# Altium project 3562.PrjPcb (part 2 of 5)

## Sheet P04_POWER.SchDoc
size 420 x 297 mm
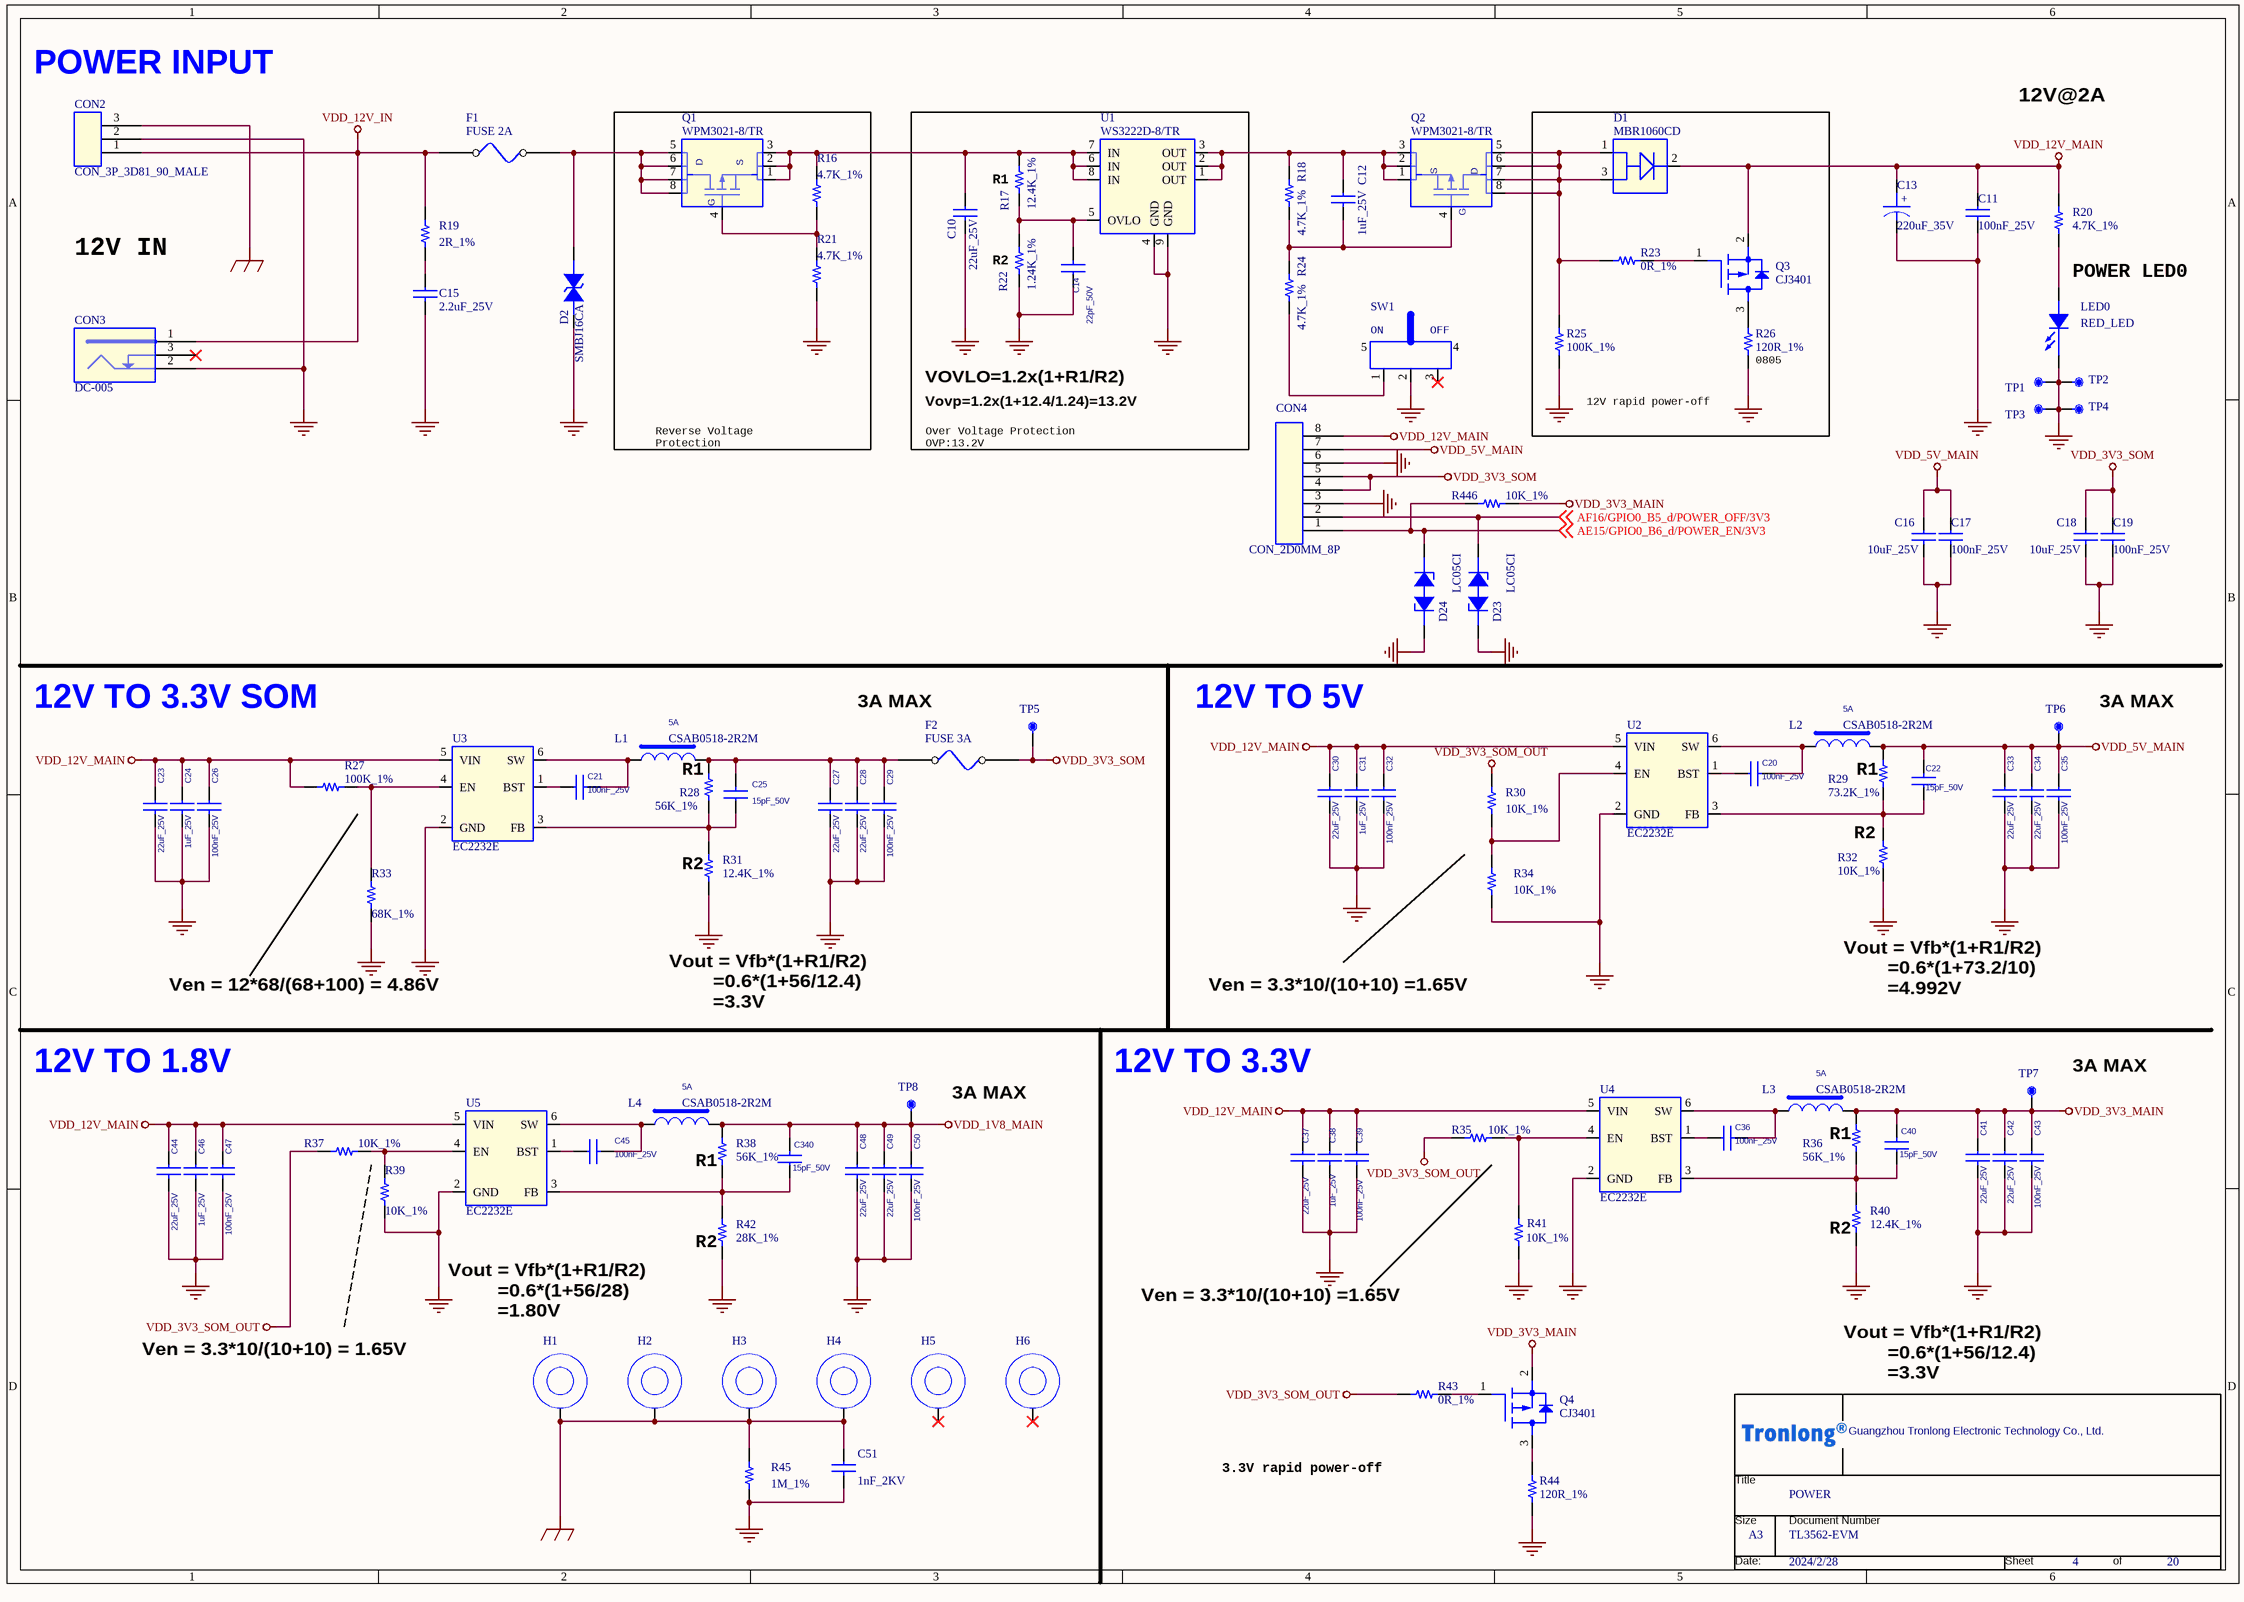
[diagram p11: P04_POWER.SchDoc]

### Parts
(Parts that share a designator on the sheet are numbered #1, #2 ... from top to bottom, then left to right.)
*#4  Page Count: 20  Page Number: 4  Page Size: A3  OrgName: Guangzhou Tronlong Electronic Technology Co., Ltd.  Title: POWER  Doc: TL3562-EVM  Page Modify Date: 2024/2/28  (hidden comment: Tronlong_TITTLE_20211115)  (graphical)
C10  22uF_25V  [C0805]
C11  100nF_25V  [C0402]
C12  1uF_25V  [C0603]
C13  220uF_35V  [cap_alu_smd_8x10d5]
C14  22pF_50V  [C0603]
C15  2.2uF_25V  [C1206]
C16  10uF_25V  [C0603]
C17  100nF_25V  [C0402]
C18  10uF_25V  [C0603]
C19  100nF_25V  [C0402]
C20  100nF_25V  [C0402]
C21  100nF_25V  [C0402]
C22  15pF_50V  [C0402]
C23  22uF_25V  [C0805]
C24  1uF_25V  [C0603]
C25  15pF_50V  [C0402]
C26  100nF_25V  [C0402]
C27  22uF_25V  [C0805]
C28  22uF_25V  [C0805]
C29  100nF_25V  [C0402]
C30  22uF_25V  [C0805]
C31  1uF_25V  [C0603]
C32  100nF_25V  [C0402]
C33  22uF_25V  [C0805]
C34  22uF_25V  [C0805]
C35  100nF_25V  [C0402]
C36  100nF_25V  [C0402]
C37  22uF_25V  [C0805]
C38  1uF_25V  [C0603]
C39  100nF_25V  [C0402]
C40  15pF_50V  [C0402]
C41  22uF_25V  [C0805]
C42  22uF_25V  [C0805]
C43  100nF_25V  [C0402]
C44  22uF_25V  [C0805]
C45  100nF_25V  [C0402]
C46  1uF_25V  [C0603]
C47  100nF_25V  [C0402]
C48  22uF_25V  [C0805]
C49  22uF_25V  [C0805]
C50  100nF_25V  [C0402]
C51  1nF_2KV  [C1210]
C340  15pF_50V  [C0402]
CON2  CON_3P_3D81_90_MALE  [CON_3P_3D81_90_MALE_NEW]
CON3  DC-005  [con_dc005_new]
CON4  CON_2D0MM_8P  [DIP_CON_2D0MM_8P]
D1  MBR1060CD  [TO-252]
D2  SMBJ16CA  [SMB]
D23  LC05CI  [SOD323_BI]
D24  LC05CI  [SOD323_BI]
F1  FUSE 2A  [F1206]
F2  FUSE 3A  [F1206]
H1  HOLE  [MHOLE_C200D125]  (value not drawn)
H2  HOLE  [MHOLE_C200D125]  (value not drawn)
H3  HOLE  [MHOLE_C200D125]  (value not drawn)
H4  HOLE  [MHOLE_C200D125]  (value not drawn)
H5  HOLE  [MHOLE_C200D125]  (value not drawn)
H6  HOLE  [MHOLE_C200D125]  (value not drawn)
L1  CSAB0518-2R2M  Current: 5A  [SMD_CSAB0518]
L2  CSAB0518-2R2M  Current: 5A  [SMD_CSAB0518]
L3  CSAB0518-2R2M  Current: 5A  [SMD_CSAB0518]
L4  CSAB0518-2R2M  Current: 5A  [SMD_CSAB0518]
LED0  RED_LED  [CON_2P_3MM]
Q1  WPM3021-8/TR  [PSOPSOP-8L]
Q2  WPM3021-8/TR  [PSOPSOP-8L]
Q3  CJ3401  [SOT23-3]
Q4  CJ3401  [SOT23-3]
R16  4.7K_1%  [R0402]
R17  12.4K_1%  [R0402]
R18  4.7K_1%  [R0402]
R19  2R_1%  [R1210]
R20  4.7K_1%  [R0402]
R21  4.7K_1%  [R0402]
R22  1.24K_1%  [R0603]
R23  0R_1%  [R0402]
R24  4.7K_1%  [R0402]
R25  100K_1%  [R0402]
R26  120R_1%  [R0805]
R27  100K_1%  [R0402]
R28  56K_1%  [R0402]
R29  73.2K_1%  [R0402]
R30  10K_1%  [R0402]
R31  12.4K_1%  [R0402]
R32  10K_1%  [R0402]
R33  68K_1%  [R0402]
R34  10K_1%  [R0402]
R35  10K_1%  [R0402]
R36  56K_1%  [R0402]
R37  10K_1%  [R0402]
R38  56K_1%  [R0402]
R39  10K_1%  [R0402]
R40  12.4K_1%  [R0402]
R41  10K_1%  [R0402]
R42  28K_1%  [R0402]
R43  0R_1%  [R0402]
R44  120R_1%  [R0805]
R45  1M_1%  [R0603]
R446  10K_1%  [R0402]
SW1  SS-12D11L5  [sw-126_76]  (value not drawn)
TP1  Black Test Point  [TP_DIP]  (value not drawn)
TP2  Black Test Point  [TP_DIP]  (value not drawn)
TP3  Black Test Point  [TP_DIP]  (value not drawn)
TP4  Black Test Point  [TP_DIP]  (value not drawn)
TP5  SMT TP  [TP30]  (value not drawn)
TP6  SMT TP  [TP30]  (value not drawn)
TP7  SMT TP  [TP30]  (value not drawn)
TP8  SMT TP  [TP30]  (value not drawn)
U1  WS3222D-8/TR  [DFN2X2-8L]
U2  EC2232E  [SOT-23-6L]
U3  EC2232E  [SOT-23-6L]
U4  EC2232E  [SOT-23-6L]
U5  EC2232E  [SOT-23-6L]

### Blocks framed on the sheet
VOVLO=1.2x(1+R1/R2): C10 C14 R17 R22 U1

### Nets
EGND: C51.1 CON2.3 H1.1 H2.1 H3.1 H4.1 R45.1
GND: C10.2 C11.2 C13.2 C14.1 C15.2 C16.2 C17.2 C18.2 C19.2 C23.2 C24.2 C26.2 C27.2 C28.2 C29.2 C30.2 C31.2 C32.2 C33.2 C34.2 C35.2 C37.2 C38.2 C39.2 C41.2 C42.2 C43.2 C44.2 C46.2 C47.2 C48.2 C49.2 C50.2 C51.2 CON2.2 CON3.2 CON4.3 CON4.6 D2.1 D23.2(CATHODE2) D24.2(CATHODE2) LED0.2(CATHODE) R21.1 R22.2 R25.1 R26.2 R31.1 R32.1 R33.1 R34.1 R39.1 R40.1 R41.1 R42.1 R44.2 R45.2 SW1.2 TP1.1 TP2.1 TP3.1 TP4.1 U1.4(GND) U1.9(GND) U2.2(GND) U3.2(GND) U4.2(GND) U5.2(GND)
VDD_1V8_MAIN: C48.1 C49.1 C50.1 C340.2 L4.2 R38.2 TP8.1
VDD_3V3_MAIN: C40.2 C41.1 C42.1 C43.1 L3.2 Q4.2(SOURCE) R36.2 R446.1 TP7.1
VDD_3V3_SOM: C18.1 C19.1 CON4.4 CON4.5 F2.2 TP5.1
VDD_3V3_SOM_OUT: R30.2 R35.2 R37.1 R43.2
VDD_5V_MAIN: C16.1 C17.1 C22.2 C33.1 C34.1 C35.1 CON4.7 L2.2 R29.2 TP6.1
VDD_12V_IN: CON2.1 CON3.1 F1.1 R19.2
VDD_12V_MAIN: C11.1 C13.1 C23.1 C24.1 C26.1 C30.1 C31.1 C32.1 C37.1 C38.1 C39.1 C44.1 C46.1 C47.1 CON4.8 D1.2 Q3.2(SOURCE) R20.1 R27.1 U2.5(VIN) U3.5(VIN) U4.5(VIN) U5.5(VIN)
AE15/GPIO0_B6_d/POWER_EN/3V3: CON4.1 D24.1(ANODE1) R446.2 ; off-sheet AE15/GPIO0_B6_d/POWER_EN/3V3
AF16/GPIO0_B5_d/POWER_OFF/3V3: CON4.2 D23.1(ANODE1) ; off-sheet AF16/GPIO0_B5_d/POWER_OFF/3V3
NetC10_1: C10.1 Q1.1(S1) Q1.2(S2) Q1.3(S3) R16.2 R17.1 U1.6(IN) U1.7(IN) U1.8(IN)
NetC12_1: C12.1 Q2.1(S1) Q2.2(S2) Q2.3(S3) R18.2 U1.1(OUT) U1.2(OUT) U1.3(OUT)
NetC12_2: C12.2 Q2.4(G) R18.1 R24.2
NetC14_2: C14.2 R17.2 R22.1 U1.5(OVLO)
NetC15_1: C15.1 R19.1
NetC20_1: C20.1 U2.1(BST)
NetC20_2: C20.2 L2.1 U2.6(SW)
NetC21_1: C21.1 U3.1(BST)
NetC21_2: C21.2 L1.1 U3.6(SW)
NetC22_1: C22.1 R29.1 R32.2 U2.3(FB)
NetC25_1: C25.1 R28.1 R31.2 U3.3(FB)
NetC25_2: C25.2 C27.1 C28.1 C29.1 F2.1 L1.2 R28.2
NetC36_1: C36.1 U4.1(BST)
NetC36_2: C36.2 L3.1 U4.6(SW)
NetC40_1: C40.1 R36.1 R40.2 U4.3(FB)
NetC45_1: C45.1 U5.1(BST)
NetC45_2: C45.2 L4.1 U5.6(SW)
NetC340_1: C340.1 R38.1 R42.2 U5.3(FB)
NetD1_1: D1.1 D1.3 Q2.5(D1) Q2.6(D2) Q2.7(D3) Q2.8(D4) R23.2 R25.2
NetD2_2: D2.2 F1.2 Q1.5(D1) Q1.6(D2) Q1.7(D3) Q1.8(D4)
NetLED0_1: LED0.1(ANODE) R20.2
NetQ1_4: Q1.4(G) R16.1 R21.2
NetQ3_1: Q3.1(GATE) R23.1
NetQ3_3: Q3.3(DRAIN) R26.1
NetQ4_1: Q4.1(GATE) R43.1
NetQ4_3: Q4.3(DRAIN) R44.1
NetR24_1: R24.1 SW1.1
NetR27_2: R27.2 R33.2 U3.4(EN)
NetR30_1: R30.1 R34.2 U2.4(EN)
NetR35_1: R35.1 R41.2 U4.4(EN)
NetR37_2: R37.2 R39.2 U5.4(EN)

Not connected (* = marked no-connect by the designer): CON3 3*; H5 1*; H6 1*; SW1 3* 4 5

### Notes on the sheet
- (near CON2) POWER INPUT
- 12V@2A
- (near R17) R1
- 12V IN
- (near R22) R2
- POWER LED0
- (near R26) 0805
- Reverse Voltage
  Protection
- Over Voltage Protection
  OVP:13.2V
- Vovp=1.2x(1+12.4/1.24)=13.2V
- 12V rapid power-off
- 12V TO 3.3V SOM
- 3A MAX
- 12V TO 5V
- (near TP6) 3A MAX
- (near L1) R1
- R1
- (near R32) R2
- (near R31) R2
- Ven = 12*68/(68+100) = 4.86V
- Ven = 3.3*10/(10+10) =1.65V
- Vout = Vfb*(1+R1/R2)
  =0.6*(1+73.2/10)
  =4.992V
- Vout = Vfb*(1+R1/R2)
  =0.6*(1+56/12.4)
  =3.3V
- (near TP7) 3A MAX
- 12V TO 1.8V
- (near TP8) 3A MAX
- 12V TO 3.3V
- (near R38) R1
- (near R42) R2
- (near R40) R2
- (near R42) Vout = Vfb*(1+R1/R2)
  =0.6*(1+56/28)
  =1.80V
- Ven = 3.3*10/(10+10) = 1.65V
- 3.3V rapid power-off
- (in symbol CAP POL_Dup1) +
- (in symbol switch_7) ON; OFF
- (in symbol Tronlong_TITTLE_20211115) Title; Size; Document Number; Date:; Sheet; of
- (in symbol WPM3021) S; D

### Library data of the parts
*#4 = Tronlong_TITTLE_20211115: RevCode: A?; Page Create Date: March  8, 1995
C10 C37 C41 C42 = CAP NP_Dup3: 贴片陶瓷电容,22uF,20%,25V,X5R; Manufacturer Character: 中国大陆; Operation Temperature（℃）: -55~85℃; As-Welded: /; Temperature: -55~125℃; PCB Footprint: C0805
C11 = CAP NP_Dup3: 贴片陶瓷电容,100nF,10%,25V,X5R; Manufacturer Character: 中国大陆; As-Welded: /; Operation Temperature（℃）: -55~85℃; room: DCIN; Temperature: -55~125℃; PCB Footprint: C0402
C12 C38 = CAP NP_Dup3: 贴片陶瓷电容,1uF,10%,25V,X5R; Manufacturer Character: 中国大陆; As-Welded: /; Operation Temperature（℃）: -55~85℃; PCB Footprint: C0603
C13 = CAP POL_Dup1: 贴片式铝电解电容,220uF,20%,35V; Manufacturer PartNumber: RVT1V221M0810VG; Manufacturer: 东莞市合粤电子有限公司（Heyue）; Manufacturer Character: 中国大陆; As-Welded: /; room: DCIN; Operation Temperature（℃）: -55~105℃; Temperature: -55~105℃; PCB Footprint: cap_alu_smd_8x10d5
C14 = CAP NP_Dup3: 贴片陶瓷电容,22pF,5%,50V,C0G; Manufacturer Character: 中国大陆; As-Welded: /; Operation Temperature（℃）: -55~125℃; Temperature: -55~125℃; PCB Footprint: C0603
C15 = CAP NP_Dup3: 贴片陶瓷电容,2.2uF,20%,25V,Y5V; Manufacturer Character: 中国大陆; As-Welded: /; Operation Temperature（℃）: -20~85℃; PCB Footprint: C1206
C16 C18 = CAP NP_Dup3: 贴片陶瓷电容,10uF,10%,10V,X5R; Manufacturer Character: 中国大陆; As-Welded: /; Operation Temperature（℃）: -55~85℃; PCB Footprint: C0603
C17 C19-C21 C26 C29 C32 C35 = CAP NP_Dup3: 贴片陶瓷电容,100nF,10%,25V,X5R; Manufacturer Character: 中国大陆; Operation Temperature（℃）: -55~85℃; As-Welded: /; PCB Footprint: C0402
  C20 C21 C26 C29 C32 C35: Temperature: -55~125℃
C22 C25 C340 = CAP NP_Dup3: 贴片陶瓷电容,15pF,5%,50V,COG; Manufacturer Character: 中国大陆; Operation Temperature（℃）: -55~125℃; As-Welded: /; Temperature: -55~125℃; PCB Footprint: C0402
C23 C27 C28 C30 C33 C34 C48 C49 = CAP NP_Dup3: 贴片陶瓷电容,22uF,20%,25V,X5R; Manufacturer Character: 中国大陆; As-Welded: /; Operation Temperature（℃）: -55~85℃; Temperature: -55~125℃; PCB Footprint: C0805
C24 C31 = CAP NP_Dup3: 贴片陶瓷电容,1uF,10%,25V,X5R; Manufacturer Character: 中国大陆; Operation Temperature（℃）: -55~85℃; As-Welded: /; PCB Footprint: C0603
C36 C39 C43 = CAP NP_Dup3: 贴片陶瓷电容,100nF,10%,25V,X5R; Manufacturer Character: 中国大陆; As-Welded: /; Operation Temperature（℃）: -55~85℃; Temperature: -55~125℃; PCB Footprint: C0402
C40 = CAP NP_Dup3: 贴片陶瓷电容,15pF,5%,50V,COG; Manufacturer Character: 中国大陆; As-Welded: /; Operation Temperature（℃）: -55~125℃; PCB Footprint: C0402; Temperature: -55~125℃
C44 = CAP NP_Dup3: 贴片陶瓷电容,22uF,20%,25V,X5R; Manufacturer Character: 中国大陆; Operation Temperature（℃）: -55~85℃; Characteristic: <Characteristic>; As-Welded: /; Temperature: -55~155℃; PCB Footprint: C0805
C45 C47 = CAP NP_Dup3: 贴片陶瓷电容,100nF,10%,25V,X5R; Manufacturer Character: 中国大陆; As-Welded: /; Operation Temperature（℃）: -55~85℃; Characteristic: <Characteristic>; Temperature: -55~155℃; PCB Footprint: C0402
C46 = CAP NP_Dup3: 贴片陶瓷电容,1uF,10%,25V,X5R; Manufacturer Character: 中国大陆; As-Welded: /; Characteristic: <Characteristic>; Operation Temperature（℃）: -55~85℃; PCB Footprint: C0603
C50 = CAP NP_Dup3: 贴片陶瓷电容,100nF,10%,25V,X5R; Manufacturer Character: 中国大陆; Characteristic: <Characteristic>; Operation Temperature（℃）: -55~85℃; As-Welded: /; Temperature: -55~155℃; PCB Footprint: C0402
C51 = CAP NP_Dup3: 贴片陶瓷电容,1nF,10%,2KV,X7R; Manufacturer Character: 中国大陆; As-Welded: /; Operation Temperature（℃）: -55~125℃; Temperature: –55~125℃; PCB Footprint: C1210
CON2 = CON3_Dup1: 端子座,3PIN,间距3.81MM,90度,绿色,插件; Manufacturer PartNumber: KF2EDGR-3.81-03P-14; Manufacturer: 慈溪市科发电子有限公司（KEFA）; Manufacturer Character: 中国大陆; As-Welded: /; room: 17; Operation Temperature（℃）: -40~105℃; PCB Footprint: CON_3P_3D81_90_MALE_NEW
CON3 = DC-005: DC-005,3PIN,90度,母座,2.0MM内径,插件; Manufacturer Character: 中国大陆; Manufacturer: 广东纳特康电子股份有限公司(natconn); Manufacturer PartNumber: 305-OT03SZD001; As-Welded: /; Operation Temperature（℃）: -30~70℃; room: dcin; Temperature: -30~70; PCB Footprint: con_dc005_new
CON4 = CON8: 端子座,1x8PIN,间距2.00MM,180度,插件; Manufacturer: 深圳市长江连接器有限公司（CJT）; Manufacturer Character: 中国大陆; Manufacturer PartNumber: A2001WV-8P-3; As-Welded: /; Operation Temperature（℃）: -40~105℃; PCB Footprint: DIP_CON_2D0MM_8P
D1 = MBRB1045_0: 肖特基二极管,VR=60V,IF=10A,VF=0.75V@5A,两路; Manufacturer Character: 中国大陆; Manufacturer: 辽宁芯诺电子科技有限公司（XINNUO）; Operation Temperature（℃）: -55~150℃; As-Welded: /; PCB Footprint: TO-252; Manufacturer PartNumber: MBR1060CD; Temperature: -55~150℃
D2 = DIODE-TRIG: TVS二极管,VRWM=16V,VBR=17.8V,一组,双向; Manufacturer Character: 中国大陆; Manufacturer: 江苏长晶科技有限公司（JSCJ）; As-Welded: /; Operation Temperature（℃）: -55~150℃; room: DCIN; Temperature: -55~150℃; Manufacturer PartNumber: SMBJ16CA; PCB Footprint: SMB
D23 D24 = DIODE BREAKDOWN_2: TVS二极管,VRWM=5V,VBR=6V,一组,双向,30KV,30KV; Manufacturer Part Number: PESD3V3L1BA; Manufacturer: 上海雷卯电子科技有限公司（Leiditech）; Manufacturer Character: 中国大陆; As-Welded: /; Operation Temperature（℃）: -55~125℃; room: KEY; Temperature: -55~155℃; Manufacturer PartNumber: LC05CI; PCB Footprint: SOD323_BI
F1 = FUSE: 保险丝，Vmax=72V,Imax=50A,Ihold=2A; Manufacturer PartNumber: F12T2; Manufacturer: 东莞市竞沃电子科技有限公司（TLC）; Manufacturer Character: 中国大陆; Operation Temperature（℃）: -55~125℃; As-Welded: /; PCB Footprint: F1206; Temperature: -55~125℃
F2 = FUSE: 保险丝，Vmax=72V,Imax=50A,Ihold=3A; Manufacturer PartNumber: F12T3; Manufacturer: 东莞市竞沃电子科技有限公司（TLC）; Manufacturer Character: 中国大陆; As-Welded: /; Operation Temperature（℃）: -55~125℃; Temperature: -55~125℃; PCB Footprint: F1206
H1-H6 = HOLE: Manufacturer Character: 中国大陆; As-Welded: DNP; PCB Footprint: MHOLE_C200D125
L1 L2 = INDUCTOR: 贴片功率电感,2.2uH,0.035Ω,Isat=6.5A,Irms=5A; Manufacturer Character: 中国大陆; Manufacturer: 深圳市科达嘉电子有限公司（CODACA）; Parameter: L2520，奇力新一体成型电感，最大额定电流3A，内阻65毫欧，20%; As-Welded: /; Operation Temperature（℃）: -40~125℃; Temperature: -40~125℃; Manufacturer PartNumber: CSAB0518-2R2M; PCB Footprint: SMD_CSAB0518
L3 = INDUCTOR: 贴片功率电感,2.2uH,0.035Ω,Isat=6.5A,Irms=5A; Manufacturer: 深圳市科达嘉电子有限公司（CODACA）; Manufacturer Character: 中国大陆; Parameter: L2520，奇力新一体成型电感，最大额定电流3A，内阻65毫欧，20%; Operation Temperature（℃）: -40~125℃; As-Welded: /; PCB Footprint: SMD_CSAB0518; Manufacturer PartNumber: CSAB0518-2R2M; Temperature: -40~125℃
L4 = INDUCTOR: 贴片功率电感,2.2uH,0.035Ω,Isat=6.5A,Irms=5A; Manufacturer Character: 中国大陆; Manufacturer: 深圳市科达嘉电子有限公司（CODACA）; Parameter: L2520，奇力新一体成型电感，最大额定电流3A，内阻65毫欧，20%; Operation Temperature（℃）: -40~125℃; As-Welded: /; PCB Footprint: SMD_CSAB0518; Manufacturer PartNumber: CSAB0518-2R2M; Temperature: -40~125℃
LED0 = LED: 直插式发光二极管,红色,带灯座; Manufacturer PartNumber: JH-03B2RD1E-DL; Manufacturer: 深圳市巨弘光电有限公司（JUHLIGHT）; Manufacturer Character: 中国大陆; Operation Temperature（℃）: -40~100℃; As-Welded: /; PCB Footprint: CON_2P_3MM; room: LED; Temperature: -40~105℃
Q1 = WPM3021: MOSFET,P沟道,VDSS=-30V,VGSS=±25V,ID=-13A,PD=3.8W,VGS(th)=-3V; Manufacturer Character: 中国大陆; Manufacturer: 上海韦尔半导体股份有限公司（WILLSEMI）; Operation Temperature（℃）: -55~150℃; As-Welded: /; PCB Footprint: PSOPSOP-8L; Manufacturer PartNumber: WPM3021-8/TR; Temperature: -40~85℃
Q2 = WPM3021: MOSFET,P沟道,VDSS=-30V,VGSS=±25V,ID=-13A,PD=3.8W,VGS(th)=-3V; Manufacturer: 上海韦尔半导体股份有限公司（WILLSEMI）; Manufacturer Character: 中国大陆; Operation Temperature（℃）: -55~150℃; As-Welded: /; PCB Footprint: PSOPSOP-8L; Temperature: -40~85℃; Manufacturer PartNumber: WPM3021-8/TR
Q3 Q4 = MOSFET P SOT_Dup1: MOSFET,P沟道,VDSS=-30V,VGSS=±12V,ID=-4.2A,PD=0.35W,VGS(th)=-1.3V; Manufacturer: 江苏长晶科技有限公司（JSCJ）; Manufacturer Character: 中国大陆; room: DCIN; Operation Temperature（℃）: -55~150℃; As-Welded: /; PCB Footprint: SOT23-3; Temperature: -55~150℃; Manufacturer Part Number: CJ3401; Manufacturer PartNumber: CJ3401
R16 R18 R24 = Resistor_Dup3: 贴片电阻,4.7K,±1%,1/16W; Manufacturer Character: 中国大陆; CLASS: DISCRETE; As-Welded: /; Operation Temperature（℃）: -55~155℃; Temperature: -55~155℃; PCB Footprint: R0402
R17 = Resistor_Dup3: 贴片电阻,12.4K,±1%,1/16W; Manufacturer Character: 中国大陆; CLASS: DISCRETE; Operation Temperature（℃）: -55~155℃; As-Welded: /; Temperature: -55~155℃; PCB Footprint: R0402
R19 = Resistor_Dup3: 贴片电阻,2R,±1%,1/3W; Manufacturer Character: 中国大陆; CLASS: DISCRETE; As-Welded: /; Operation Temperature（℃）: -55~155℃; PCB Footprint: R1210
R20 = Resistor_Dup3: 贴片电阻,4.7K,±1%,1/16W; Manufacturer Character: 中国大陆; CLASS: DISCRETE; As-Welded: /; room: DCIN; Operation Temperature（℃）: -55~155℃; PCB Footprint: R0402
R21 = Resistor_Dup3: 贴片电阻,4.7K,±1%,1/16W; Manufacturer Character: 中国大陆; CLASS: DISCRETE; Operation Temperature（℃）: -55~155℃; As-Welded: /; Temperature: -55~155℃; PCB Footprint: R0402
R22 = Resistor_Dup3: 贴片电阻,12.4K,±1%,1/10W; Manufacturer Character: 中国大陆; CLASS: DISCRETE; As-Welded: /; Operation Temperature（℃）: -55~155℃; PCB Footprint: R0603
R23 R43 = Resistor_Dup3: 0R,±1%,R0402,≥1/16W; Manufacturer Character: 中国大陆; CLASS: DISCRETE; As-Welded: /; Operation Temperature（℃）: -55~155℃; PCB Footprint: R0402
R25 = Resistor_Dup3: 贴片电阻,100K,±1%,1/16W; Manufacturer Character: 中国大陆; CLASS: DISCRETE; As-Welded: /; Operation Temperature（℃）: -55~155℃; PCB Footprint: R0402; Temperature: -55~155℃
R26 = Resistor_Dup3: 贴片电阻,120R,±1%,1/8W; Manufacturer Character: 中国大陆; CLASS: DISCRETE; As-Welded: /; Operation Temperature（℃）: -55~155℃; room: DCIN; Temperature: -55~155℃; PCB Footprint: R0805
R27 = Resistor_Dup3: 贴片电阻,100K,±1%,1/16W; Manufacturer Character: 中国大陆; CLASS: DISCRETE; Operation Temperature（℃）: -55~155℃; As-Welded: /; Temperature: -55~155℃; PCB Footprint: R0402
R28 = Resistor_Dup3: 贴片电阻,56K,±1%,1/16W; Manufacturer Character: 中国大陆; CLASS: DISCRETE; Operation Temperature（℃）: -55~155℃; As-Welded: /; Temperature: -55~155℃; PCB Footprint: R0402
R29 = Resistor_Dup3: 贴片电阻,73.2K,±1%,1/16W; Manufacturer Character: 中国大陆; CLASS: DISCRETE; Operation Temperature（℃）: -55~155℃; As-Welded: /; Temperature: -55~155℃; PCB Footprint: R0402
R30 R32 R34 = Resistor_Dup3: 贴片电阻,10K,±1%,1/16W; Manufacturer Character: 中国大陆; CLASS: DISCRETE; As-Welded: /; Operation Temperature（℃）: -55~155℃; PCB Footprint: R0402
  R30 R34: Temperature: –55~155℃
  R32: Temperature: -55~155℃
R31 R40 = Resistor_Dup3: 贴片电阻,12.4K,±1%,1/16W; Manufacturer Character: 中国大陆; CLASS: DISCRETE; As-Welded: /; Operation Temperature（℃）: -55~155℃; Temperature: -55~155℃; PCB Footprint: R0402
R33 = Resistor_Dup3: 贴片电阻,68K,±1%,1/16W; Manufacturer Character: 中国大陆; CLASS: DISCRETE; Operation Temperature（℃）: -55~155℃; As-Welded: /; Temperature: -55~155℃; PCB Footprint: R0402
R35 R37 R39 R41 R446 = Resistor_Dup3: 贴片电阻,10K,±1%,1/16W; Manufacturer Character: 中国大陆; CLASS: DISCRETE; Operation Temperature（℃）: -55~155℃; As-Welded: /; PCB Footprint: R0402
  R35 R41: Temperature: –55~155℃
  R37 R39 R446: Temperature: -55~155℃
R36 R38 = Resistor_Dup3: 贴片电阻,56K,±1%,1/16W; Manufacturer Character: 中国大陆; CLASS: DISCRETE; As-Welded: /; Operation Temperature（℃）: -55~155℃; Temperature: -55~155℃; PCB Footprint: R0402
R42 = Resistor_Dup3: 28K,±1%,R0402,≥1/16W; Manufacturer Character: 中国大陆; CLASS: DISCRETE; As-Welded: /; Operation Temperature（℃）: -40~85℃; Temperature: -55~155℃; PCB Footprint: R0402
R44 = Resistor_Dup3: 贴片电阻,120R,±1%,1/8W; Manufacturer Character: 中国大陆; CLASS: DISCRETE; As-Welded: /; room: DCIN; Operation Temperature（℃）: -55~155℃; Temperature: -55~155℃; PCB Footprint: R0805
R45 = Resistor_Dup3: 贴片电阻,1M,±1%,1/10W; Manufacturer Character: 中国大陆; CLASS: DISCRETE; As-Welded: /; room: USB HUB; Operation Temperature（℃）: -55~155℃; PCB Footprint: R0603
SW1 = switch_7: 拨动开关，2档3脚侧拨开关,黑色,90度,短柄; Manufacturer: 广东星坤科技股份有限公司（XKB）; Manufacturer Character: 中国大陆; As-Welded: /; PCB Footprint: sw-126_76; Manufacturer PartNumber: SS-12D11L5
TP1 TP3 = TP-S40: 黑色直插测试柱; Manufacturer: 深圳市保定五金塑胶有限公司; Manufacturer PartNumber: TP-5011; Manufacturer Character: 中国大陆; Characteristic: Test point,diameter=1.0mm; Operation Temperature（℃）: -40~85℃; As-Welded: /; PCB Footprint: TP_DIP
TP2 = TP-S40: 黑色直插测试柱; Manufacturer PartNumber: TP-5011; Manufacturer: 深圳市保定五金塑胶有限公司; Manufacturer Character: 中国大陆; Characteristic: Test point,diameter=1.0mm; Operation Temperature（℃）: -40~85℃; As-Welded: /; PCB Footprint: TP_DIP
TP4 = TP-S40: 黑色直插测试柱; Manufacturer Character: 中国大陆; Manufacturer: 深圳市保定五金塑胶有限公司; Manufacturer PartNumber: TP-5011; Characteristic: Test point,diameter=1.0mm; Operation Temperature（℃）: -40~85℃; As-Welded: /; PCB Footprint: TP_DIP
TP5-TP8 = TP-S40: Manufacturer Character: 中国大陆; Characteristic: Test point,diameter=1.0mm; As-Welded: /; PCB Footprint: TP30
U1 = WS3222D-8/TR: MOSFET,P沟道,VDSS=-30V,VGSS=±25V,ID=-13A,PD=3.8W,VGS(th)=-3V; Manufacturer Character: 中国大陆; Manufacturer: 上海韦尔半导体股份有限公司（WILLSEMI）; As-Welded: /; Operation Temperature（℃）: -40~85℃; PCB Footprint: DFN2X2-8L; Temperature: -40~85℃; Manufacturer PartNumber: WS3222D-8/TR
U2 U3 = WD1304E30: DC/DC,Buck,Vin:4.5V~17V,Vout:0.6V~6V,3A,1·; Manufacturer: 上海芯强微电子股份有限公司（Ecranic）; Manufacturer Character: 中国大陆; As-Welded: /; Operation Temperature（℃）: -40~85℃; Manufacturer PartNumber: EC2232E; Temperature: -40~85℃; PCB Footprint: SOT-23-6L
U4 = WD1304E30: DC/DC,Buck,Vin:4.5V~17V,Vout:0.6V~6V,3A,1·; Manufacturer: 上海芯强微电子股份有限公司（Ecranic）; Manufacturer Character: 中国大陆; Operation Temperature（℃）: -40~85℃; As-Welded: /; PCB Footprint: SOT-23-6L; Temperature: -40~85℃; Manufacturer PartNumber: EC2232E
U5 = WD1304E30_0: DC/DC,Buck,Vin:4.5V~17V,Vout:0.6V~6V,3A,1·; Manufacturer Character: 中国大陆; Manufacturer: 上海芯强微电子股份有限公司（Ecranic）; Operation Temperature（℃）: -40~85℃; As-Welded: /; PCB Footprint: SOT-23-6L; Temperature: -40~125℃; Manufacturer PartNumber: EC2232E

## Sheet P05_BOOT SET_KEY_LED_SPI_ADC.SchDoc
size 420 x 297 mm
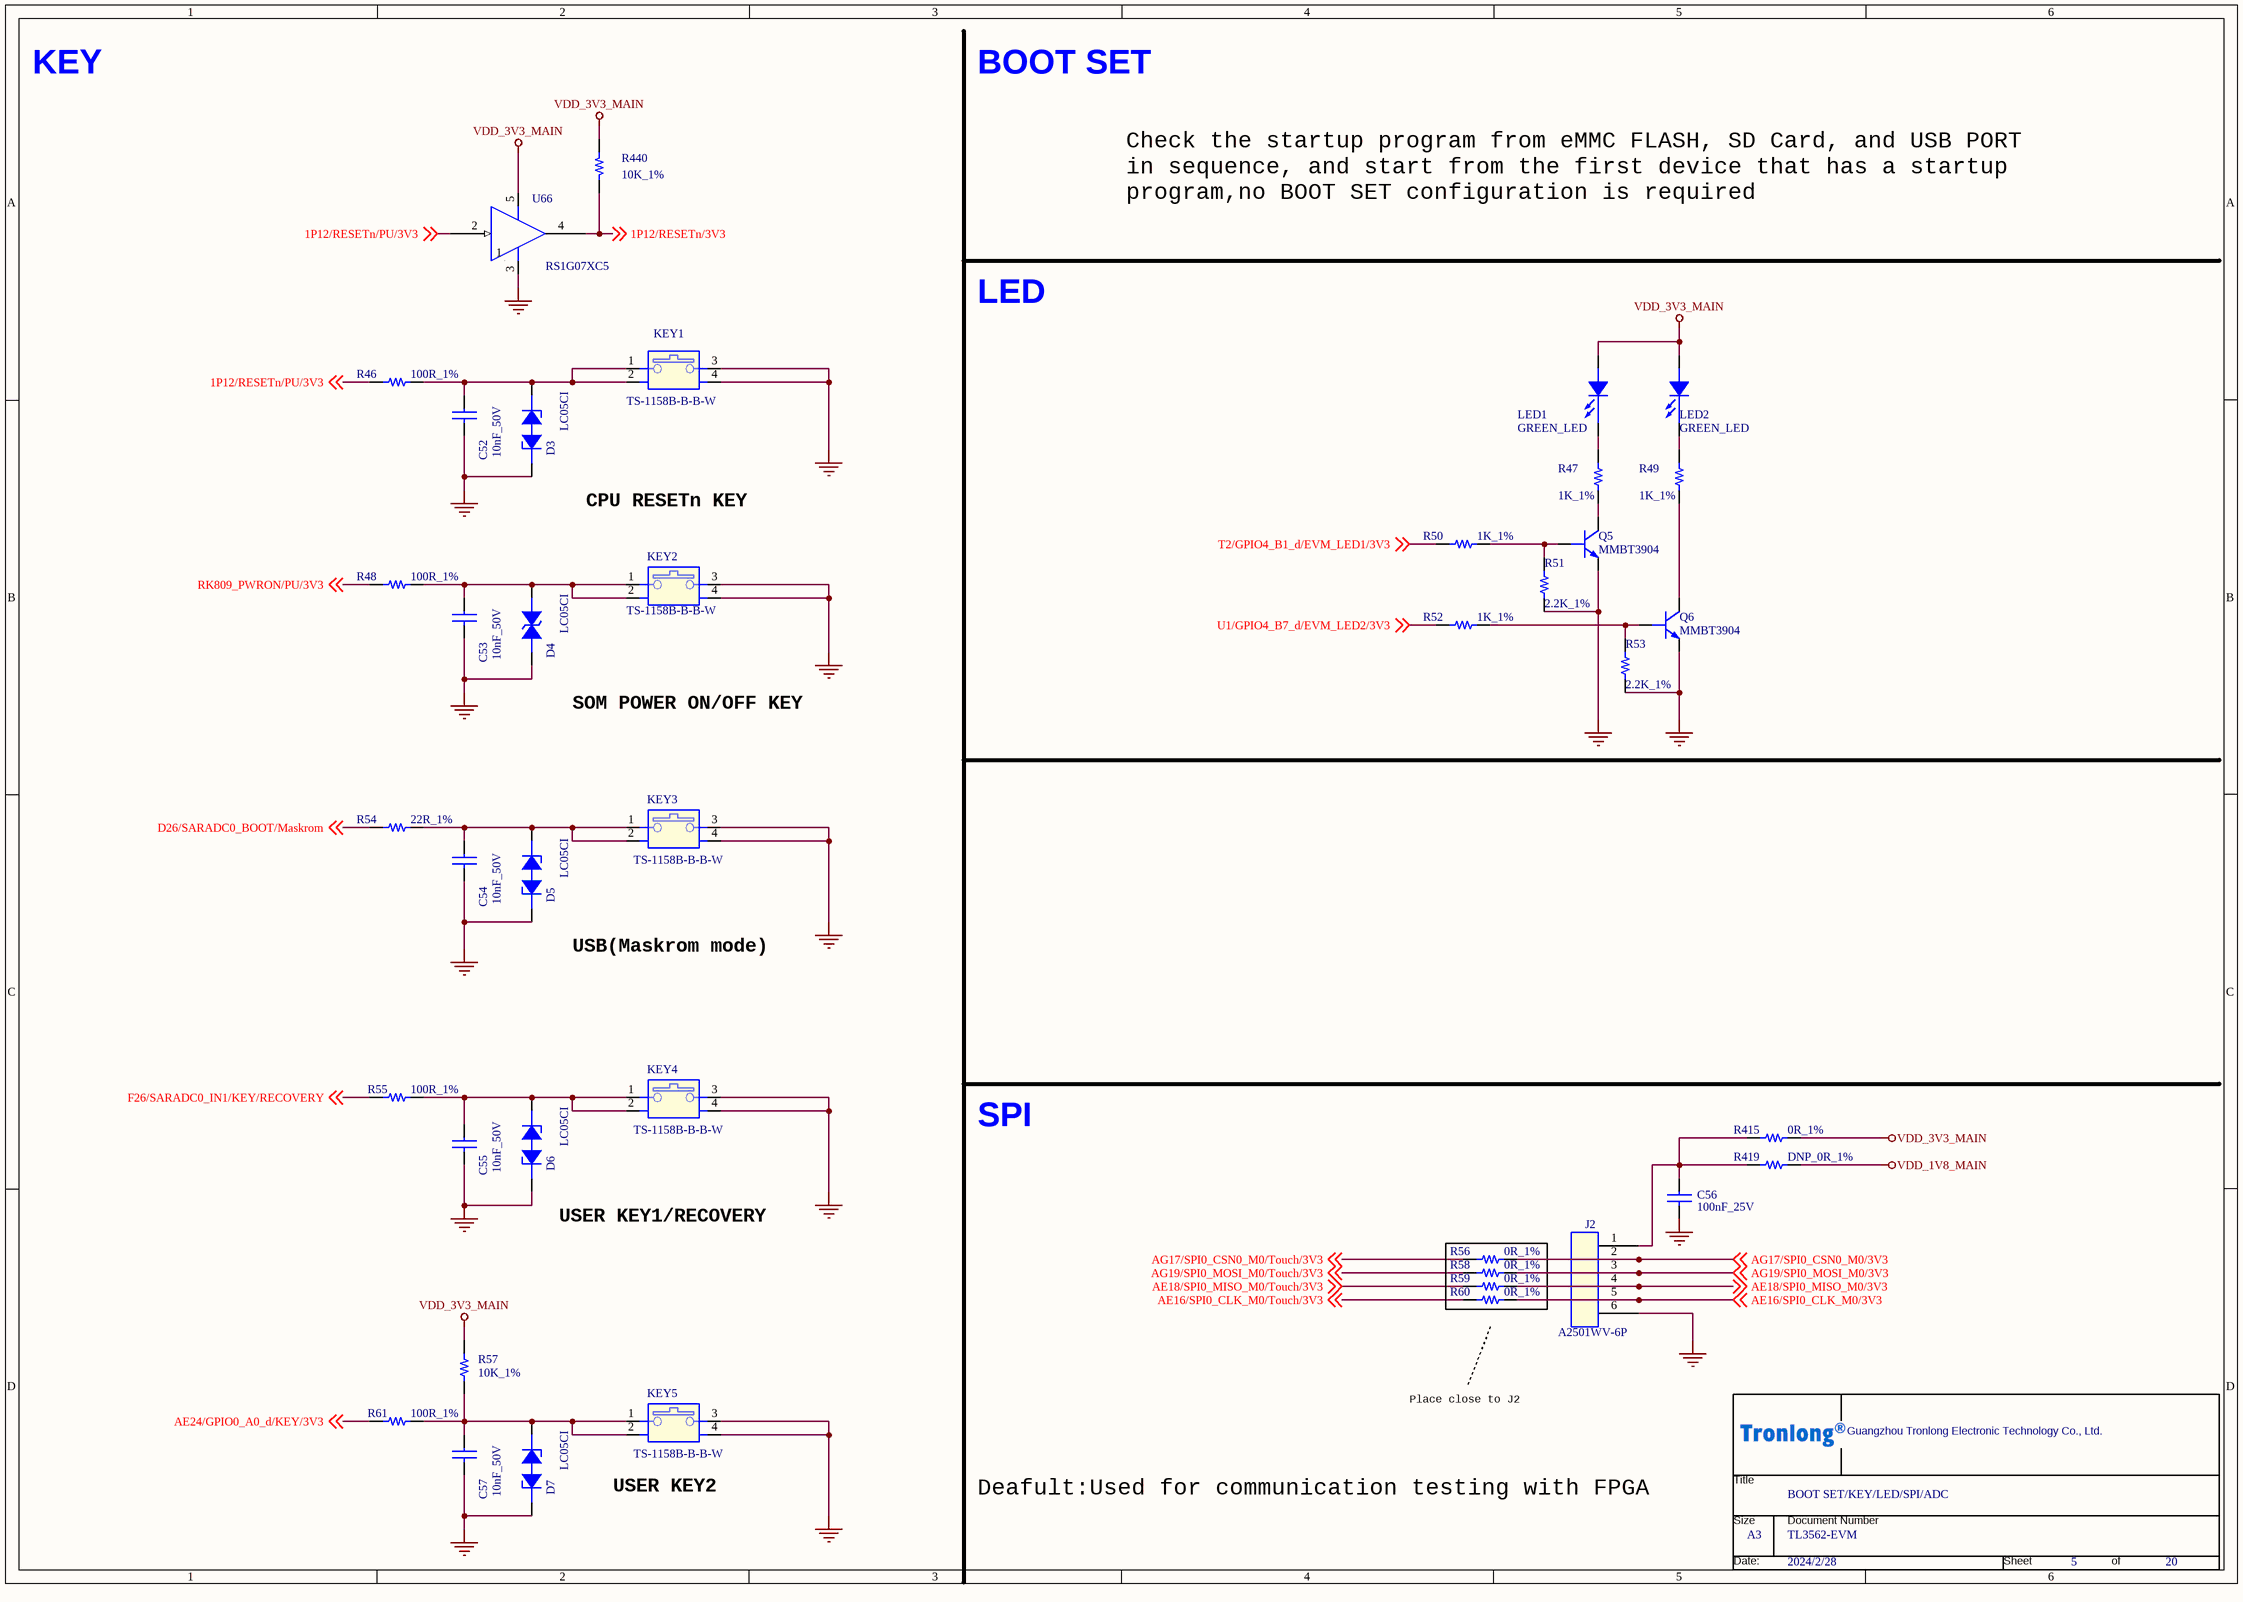
[diagram p12: P05_BOOT SET_KEY_LED_SPI_ADC.SchDoc]

### Parts
(Parts that share a designator on the sheet are numbered #1, #2 ... from top to bottom, then left to right.)
*#5  Page Count: 20  Page Number: 5  Page Size: A3  OrgName: Guangzhou Tronlong Electronic Technology Co., Ltd.  Title: BOOT SET/KEY/LED/SPI/ADC  Doc: TL3562-EVM  Page Modify Date: 2024/2/28  (hidden comment: Tronlong_TITTLE_20211115)  (graphical)
C52  10nF_50V  [C0402]
C53  10nF_50V  [C0402]
C54  10nF_50V  [C0402]
C55  10nF_50V  [C0402]
C56  100nF_25V  [C0402]
C57  10nF_50V  [C0402]
D3  LC05CI  [SOD323_BI]
D4  LC05CI  [SOD323_BI]
D5  LC05CI  [SOD323_BI]
D6  LC05CI  [SOD323_BI]
D7  LC05CI  [SOD323_BI]
J2  A2501WV-6P  [CON_XH_1x6P_2D54_H_M_DIP]
KEY1  TS-1158B-B-B-W  [TS-1158B-B-B-W]
KEY2  TS-1158B-B-B-W  [TS-1158B-B-B-W]
KEY3  TS-1158B-B-B-W  [TS-1158B-B-B-W]
KEY4  TS-1158B-B-B-W  [TS-1158B-B-B-W]
KEY5  TS-1158B-B-B-W  [TS-1158B-B-B-W]
LED1  GREEN_LED  [CON_2P_3MM]
LED2  GREEN_LED  [CON_2P_3MM]
Q5  MMBT3904  [SOT23-3_DBZ3]
Q6  MMBT3904  [SOT23-3_DBZ3]
R46  100R_1%  [R0603]
R47  1K_1%  [R0402]
R48  100R_1%  [R0603]
R49  1K_1%  [R0402]
R50  1K_1%  [R0402]
R51  2.2K_1%  [R0603]
R52  1K_1%  [R0402]
R53  2.2K_1%  [R0603]
R54  22R_1%  [R0402]
R55  100R_1%  [R0603]
R56  0R_1%  [R0402]
R57  10K_1%  [R0402]
R58  0R_1%  [R0402]
R59  0R_1%  [R0402]
R60  0R_1%  [R0402]
R61  100R_1%  [R0603]
R415  0R_1%  [R0603]
R419  DNP_0R_1%  [R0603]
R440  10K_1%  [R0402]
U66  RS1G07XC5  [SC70-5-43M]

### Nets
GND: C52.2 C53.2 C54.2 C55.2 C56.2 C57.2 D3.2(CATHODE2) D4.2 D5.2(CATHODE2) D6.2(CATHODE2) D7.2(CATHODE2) J2.6 KEY1.3 KEY1.4 KEY2.3 KEY2.4 KEY3.3 KEY3.4 KEY4.3 KEY4.4 KEY5.3 KEY5.4 Q5.2(E) Q6.2(E) R51.1 R53.1 U66.3(GND)
VDD_1V8_MAIN: R419.2
VDD_3V3_MAIN: LED1.1(CATHODE) LED2.1(CATHODE) R57.2 R415.2 R440.2 U66.5(VCC)
1P12/RESETn/3V3: R440.1 U66.4(Y) ; off-sheet 1P12/RESETn/3V3
1P12/RESETn/PU/3V3: R46.1 U66.2(A) ; off-sheet 1P12/RESETn/PU/3V3
AE16/SPI0_CLK_M0/3V3: J2.5 R60.2 ; off-sheet AE16/SPI0_CLK_M0/3V3
AE16/SPI0_CLK_M0/Touch/3V3: R60.1 ; off-sheet AE16/SPI0_CLK_M0/Touch/3V3
AE18/SPI0_MISO_M0/3V3: J2.4 R59.2 ; off-sheet AE18/SPI0_MISO_M0/3V3
AE18/SPI0_MISO_M0/Touch/3V3: R59.1 ; off-sheet AE18/SPI0_MISO_M0/Touch/3V3
AE24/GPIO0_A0_d/KEY/3V3: R61.1 ; off-sheet AE24/GPIO0_A0_d/KEY/3V3
AG17/SPI0_CSN0_M0/3V3: J2.2 R56.2 ; off-sheet AG17/SPI0_CSN0_M0/3V3
AG17/SPI0_CSN0_M0/Touch/3V3: R56.1 ; off-sheet AG17/SPI0_CSN0_M0/Touch/3V3
AG19/SPI0_MOSI_M0/3V3: J2.3 R58.2 ; off-sheet AG19/SPI0_MOSI_M0/3V3
AG19/SPI0_MOSI_M0/Touch/3V3: R58.1 ; off-sheet AG19/SPI0_MOSI_M0/Touch/3V3
D26/SARADC0_BOOT/Maskrom: R54.1 ; off-sheet D26/SARADC0_BOOT/Maskrom
F26/SARADC0_IN1/KEY/RECOVERY: R55.1 ; off-sheet F26/SARADC0_IN1/KEY/RECOVERY
RK809_PWRON/PU/3V3: R48.1 ; off-sheet RK809_PWRON/PU/3V3
T2/GPIO4_B1_d/EVM_LED1/3V3: R50.2 ; off-sheet T2/GPIO4_B1_d/EVM_LED1/3V3
U1/GPIO4_B7_d/EVM_LED2/3V3: R52.2 ; off-sheet U1/GPIO4_B7_d/EVM_LED2/3V3
NetC52_1: C52.1 D3.1(ANODE1) KEY1.1 KEY1.2 R46.2
NetC53_1: C53.1 D4.1 KEY2.1 KEY2.2 R48.2
NetC54_1: C54.1 D5.1(ANODE1) KEY3.1 KEY3.2 R54.2
NetC55_1: C55.1 D6.1(ANODE1) KEY4.1 KEY4.2 R55.2
NetC56_1: C56.1 J2.1 R415.1 R419.1
NetC57_1: C57.1 D7.1(ANODE1) KEY5.1 KEY5.2 R57.1 R61.2
NetLED1_2: LED1.2(ANODE) R47.2
NetLED2_2: LED2.2(ANODE) R49.2
NetQ5_1: Q5.1(B) R50.1 R51.2
NetQ5_3: Q5.3(C) R47.1
NetQ6_1: Q6.1(B) R52.1 R53.2
NetQ6_3: Q6.3(C) R49.1

Not connected (* = marked no-connect by the designer): U66 1(NC)

### Notes on the sheet
- KEY
- BOOT SET
- Check the startup program from eMMC FLASH, SD Card, and USB PORT
  in sequence, and start from the first device that has a startup
  program,no BOOT SET configuration is required
- LED
- CPU RESETn KEY
- SOM POWER ON/OFF KEY
- (near D5) USB(Maskrom mode)
- SPI
- (near D6) USER KEY1/RECOVERY
- Place close to J2
- (near KEY5) USER KEY2
- Deafult:Used for communication testing with FPGA
- (in symbol Tronlong_TITTLE_20211115) Title; Size; Document Number; Date:; Sheet; of

### Library data of the parts
*#5 = Tronlong_TITTLE_20211115: RevCode: A?; Page Create Date: March  8, 1995
C52 C54 C57 = CAP NP_Dup2: 贴片陶瓷电容,10nF,10%,50V,X7R; Manufacturer Character: 中国大陆; As-Welded: /; Operation Temperature（℃）: -55~125℃; room: KEY; PCB Footprint: C0402
  C54 C57: Temperature: -55~125℃
C53 = CAP NP_Dup2: 贴片陶瓷电容,10nF,10%,50V,X7R; Manufacturer Character: 中国大陆; As-Welded: /; room: KEY; Operation Temperature（℃）: -55~125℃; PCB Footprint: C0402
C55 = CAP NP_Dup2: 贴片陶瓷电容,10nF,10%,50V,X7R; Manufacturer Character: 中国大陆; Operation Temperature（℃）: -55~125℃; room: KEY; As-Welded: /; Temperature: -55~125℃; PCB Footprint: C0402
C56 = CAP NP_Dup3: 贴片陶瓷电容,100nF,10%,25V,X5R; Manufacturer Character: 中国大陆; As-Welded: /; Operation Temperature（℃）: -55~85℃; PCB Footprint: C0402
D3 = DIODE BREAKDOWN_2: TVS二极管,VRWM=5V,VBR=6V,一组,双向,30KV,30KV; Manufacturer Part Number: PESD3V3L1BA; Manufacturer: 上海雷卯电子科技有限公司（Leiditech）; Manufacturer Character: 中国大陆; As-Welded: /; Operation Temperature（℃）: -55~125℃; room: KEY; Temperature: -55~155℃; Manufacturer PartNumber: LC05CI; PCB Footprint: SOD323_BI
D4 = DIODE-BI: TVS二极管,VRWM=5V,VBR=6V,一组,双向,30KV,30KV; Manufacturer Part Number: PESD3V3L1BA; Manufacturer: 上海雷卯电子科技有限公司（Leiditech）; Manufacturer Character: 中国大陆; As-Welded: /; Operation Temperature（℃）: -55~125℃; room: KEY; Temperature: -55~155℃; Manufacturer PartNumber: LC05CI; PCB Footprint: SOD323_BI
D5 D7 = DIODE BREAKDOWN_2: TVS二极管,VRWM=5V,VBR=6V,一组,双向,30KV,30KV; Manufacturer: 上海雷卯电子科技有限公司（Leiditech）; Manufacturer Part Number: PESD3V3L1BA; Manufacturer Character: 中国大陆; As-Welded: /; Operation Temperature（℃）: -55~125℃; room: KEY; Temperature: -60~150℃; Manufacturer PartNumber: LC05CI; PCB Footprint: SOD323_BI
D6 = DIODE BREAKDOWN_2: TVS二极管,VRWM=5V,VBR=6V,一组,双向,30KV,30KV; Manufacturer Character: 中国大陆; Manufacturer Part Number: PESD3V3L1BA; Manufacturer: 上海雷卯电子科技有限公司（Leiditech）; As-Welded: /; room: KEY; Operation Temperature（℃）: -55~125℃; Manufacturer PartNumber: LC05CI; Temperature: -60~150℃; PCB Footprint: SOD323_BI
J2 = CON6_Dup1: XH2.54  6P 连接器 180度; Manufacturer: 深圳市长江连接器有限公司（CJT）; Manufacturer Character: 中国大陆; Operation Temperature（℃）: -25~85℃; As-Welded: /; PCB Footprint: CON_XH_1x6P_2D54_H_M_DIP; Temperature: -25~85℃; Manufacturer PartNumber: A2501WV-6P
KEY1 = SW PUSHBUTTON-SPST SHIELD_0: 四脚方形按键6.4x6.5，2.5mm+1.8mm，白色硅胶键帽; Manufacturer Character: 中国大陆; Manufacturer: 广东星坤科技股份有限公司（XKB）; As-Welded: /; Operation Temperature（℃）: -40~85℃; Manufacturer PartNumber: TS-1158B-B-B-W; PCB Footprint: TS-1158B-B-B-W
KEY2 = SW PUSHBUTTON-SPST SHIELD_0: 四脚方形按键6.4x6.5，2.5mm+1.8mm，白色硅胶键帽; Manufacturer Character: 中国大陆; Manufacturer: 广东星坤科技股份有限公司（XKB）; As-Welded: /; Operation Temperature（℃）: -40~85℃; room: KEY; Manufacturer PartNumber: TS-1158B-B-B-W; Temperature: -40~85℃; PCB Footprint: TS-1158B-B-B-W
KEY3 KEY5 = SW PUSHBUTTON-SPST SHIELD_0: 四脚方形按键6.4x6.5，2.5mm+1.8mm，白色硅胶键帽; Manufacturer: 广东星坤科技股份有限公司（XKB）; Manufacturer Character: 中国大陆; As-Welded: /; room: KEY; Operation Temperature（℃）: -40~85℃; Manufacturer PartNumber: TS-1158B-B-B-W; PCB Footprint: TS-1158B-B-B-W
KEY4 = SW PUSHBUTTON-SPST SHIELD_0: 四脚方形按键6.4x6.5，2.5mm+1.8mm，白色硅胶键帽; Manufacturer Character: 中国大陆; Manufacturer: 广东星坤科技股份有限公司（XKB）; Operation Temperature（℃）: -40~85℃; room: KEY; As-Welded: /; Manufacturer PartNumber: TS-1158B-B-B-W; PCB Footprint: TS-1158B-B-B-W
LED1 = LED_0: 直插式发光二极管,绿色,带灯座; Manufacturer Character: 中国大陆; Manufacturer: 深圳市巨弘光电有限公司（JUHLIGHT）; Manufacturer PartNumber: JH-03B2YG1E-DL; As-Welded: /; Operation Temperature（℃）: -40~100℃; Temperature: -40~105℃; PCB Footprint: CON_2P_3MM
LED2 = LED_0: 直插式发光二极管,绿色,带灯座; Manufacturer PartNumber: JH-03B2YG1E-DL; Manufacturer: 深圳市巨弘光电有限公司（JUHLIGHT）; Manufacturer Character: 中国大陆; As-Welded: /; Operation Temperature（℃）: -40~100℃; Temperature: -40~105℃; PCB Footprint: CON_2P_3MM
Q5 Q6 = MMBT3904/SOT: BJT,NPN,Vceo=40V,Ic=200mA,fT=300MHz,PD=200mW; Manufacturer: 江苏长晶科技有限公司（JSCJ）; Manufacturer Character: 中国大陆; As-Welded: /; Operation Temperature（℃）: -55~150℃; Manufacturer PartNumber: MMBT3904; Temperature: -55~150℃; PCB Footprint: SOT23-3_DBZ3
R46 R48 = Resistor_Dup2: 贴片电阻,100R,±1%,1/10W; Manufacturer Character: 中国大陆; CLASS: DISCRETE; As-Welded: /; Operation Temperature（℃）: -55~155℃; room: JTAG; Temperature: -55~155℃; PCB Footprint: R0603
R47 R49 R50 R52 = Resistor_Dup3: 贴片电阻,1K,±1%,1/16W; Manufacturer Character: 中国大陆; CLASS: DISCRETE; Operation Temperature（℃）: -55~155℃; As-Welded: /; PCB Footprint: R0402
R51 R53 = Resistor_Dup3: 贴片电阻,2.2K,±1%,1/10W; Manufacturer Character: 中国大陆; CLASS: DISCRETE; Operation Temperature（℃）: -55~155℃; As-Welded: /; PCB Footprint: R0603
R54 = Resistor_Dup2: 贴片电阻,22R,±1%,1/16W; Manufacturer Character: 中国大陆; CLASS: DISCRETE; Operation Temperature（℃）: -55~155℃; room: JTAG; As-Welded: /; Temperature: -55~155℃; PCB Footprint: R0402
R55 R61 = Resistor_Dup2: 贴片电阻,100R,±1%,1/10W; Manufacturer Character: 中国大陆; CLASS: DISCRETE; Operation Temperature（℃）: -55~155℃; As-Welded: /; Temperature: -55~155℃; PCB Footprint: R0603
R56 R59 R60 = Resistor_Dup3: 0R,±1%,R0402,≥1/16W; Manufacturer Character: 中国大陆; CLASS: DISCRETE; As-Welded: /; room: 10; Operation Temperature（℃）: -55~155℃; PCB Footprint: R0402
R57 = Resistor_Dup2: 贴片电阻,10K,±1%,1/16W; Manufacturer Character: 中国大陆; CLASS: DISCRETE; Operation Temperature（℃）: -55~155℃; room: KEY; As-Welded: /; Temperature: -55~125℃; PCB Footprint: R0402
R58 = Resistor_Dup3: 0R,±1%,R0402,≥1/16W; Manufacturer Character: 中国大陆; CLASS: DISCRETE; As-Welded: /; Operation Temperature（℃）: -55~155℃; room: 10; PCB Footprint: R0402
R415 = Resistor_Dup3: 0R,±1%,R0603,≥1/10W; Manufacturer Character: 中国大陆; CLASS: DISCRETE; Operation Temperature（℃）: -55~155℃; room: RGMII1; As-Welded: /; Temperature: -55~125℃; PCB Footprint: R0603
R419 = Resistor_Dup3: 贴片电阻,0R,±1%,1/10W; Manufacturer Character: 中国大陆; CLASS: DISCRETE; Operation Temperature（℃）: -55~155℃; room: RGMII1; As-Welded: DNP; PCB Footprint: R0603; Temperature: -55~125℃
R440 = Resistor: 贴片电阻,10K,±1%,1/16W; Manufacturer Character: 中国大陆; CLASS: DISCRETE; Operation Temperature（℃）: -55~155℃; room: eth0; As-Welded: /; Temperature: -55~155℃; PCB Footprint: R0402
U66 = 1A_SN74LVC1G07: 1个1位缓冲器; PartName: SN74LVC1G07DCK; Mfr: TI; TIIntPartnumber: 1A0269; Manufacturer: 江苏润石科技有限公司（RUNIC）; Manufacturer Character: 中国大陆; Vendor: Digikey; Cost100: 1.11; Cost10K: 0.04; PCB Footprint: smd_dck5pin; DescriptiveText: Driver Open Drain output; Operation Temperature（℃）: -40~125℃; Remark: 单路开漏输出缓冲器/驱动器; MfrNum: SN74LVC1G07DCK; Temperature: -40~125℃; Manufacturer PartNumber: RS1G07XC5

## Sheet P06_DEBUG UART_RTC_WD.SchDoc
size 420 x 297 mm
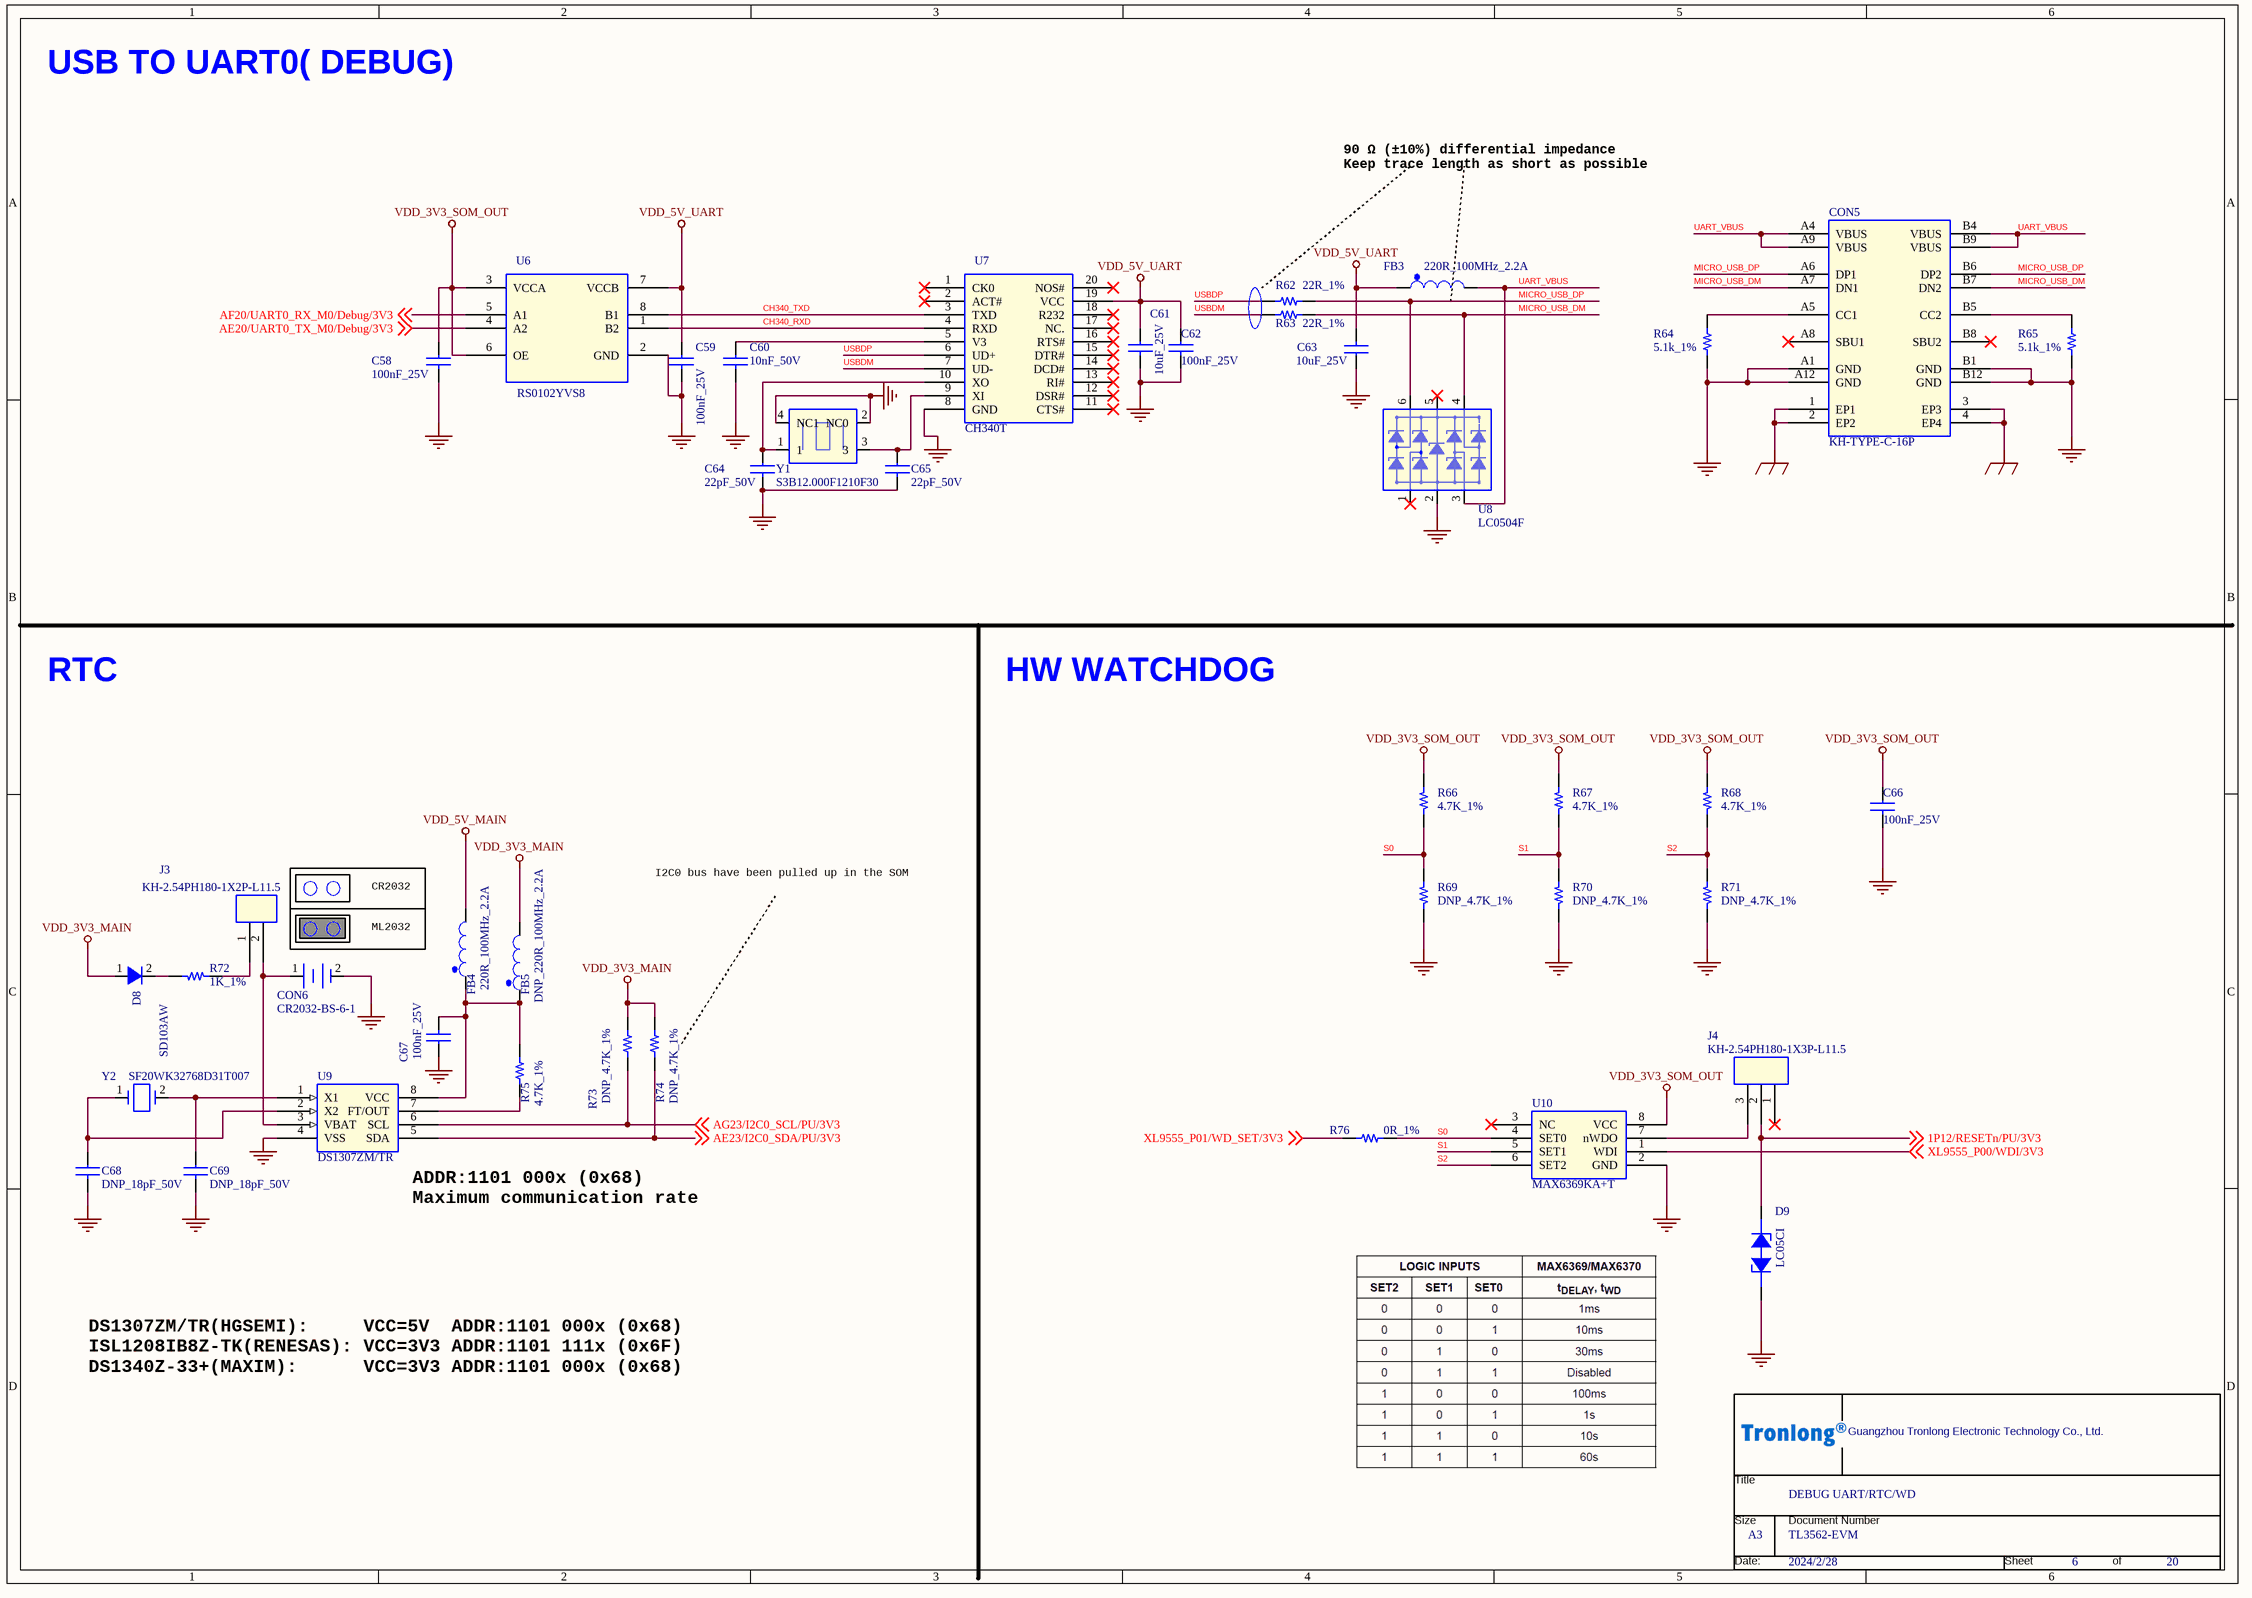
[diagram p13: P06_DEBUG UART_RTC_WD.SchDoc]

### Parts
(Parts that share a designator on the sheet are numbered #1, #2 ... from top to bottom, then left to right.)
*#6  Page Count: 20  Page Number: 6  Page Size: A3  OrgName: Guangzhou Tronlong Electronic Technology Co., Ltd.  Title: DEBUG UART/RTC/WD  Doc: TL3562-EVM  Page Modify Date: 2024/2/28  (hidden comment: Tronlong_TITTLE_20211115)  (graphical)
C58  100nF_25V  [C0402]
C59  100nF_25V  [C0402]
C60  10nF_50V  [C0402]
C61  10uF_25V  [C0603]
C62  100nF_25V  [C0402]
C63  10uF_25V  [C0603]
C64  22pF_50V  [C0603]
C65  22pF_50V  [C0603]
C66  100nF_25V  [C0402]
C67  100nF_25V  [C0402]
C68  DNP_18pF_50V  [C0603]
C69  DNP_18pF_50V  [C0603]
CON5  KH-TYPE-C-16P  [TYPE-C_16P_90_SMD]
CON6  CR2032-BS-6-1  [CON_BATTERY_CR2032]
D8  SD103AW  [SOD-123_NEW]
D9  LC05CI  [SOD323_BI]
FB3  220R_100MHz_2.2A  [L0603]
FB4  220R_100MHz_2.2A  [L0603]
FB5  DNP_220R_100MHz_2.2A  [L0603]
J3  KH-2.54PH180-1X2P-L11.5  [header_1x2p_2d54_male]
J4  KH-2.54PH180-1X3P-L11.5  [CON3_2D254]
R62  22R_1%  [R0402]
R63  22R_1%  [R0402]
R64  5.1k_1%  [R0402]
R65  5.1k_1%  [R0402]
R66  4.7K_1%  [R0402]
R67  4.7K_1%  [R0402]
R68  4.7K_1%  [R0402]
R69  DNP_4.7K_1%  [R0402]
R70  DNP_4.7K_1%  [R0402]
R71  DNP_4.7K_1%  [R0402]
R72  1K_1%  [R0402]
R73  DNP_4.7K_1%  [R0402]
R74  DNP_4.7K_1%  [R0402]
R75  4.7K_1%  [R0402]
R76  0R_1%  [R0402]
U6  RS0102YVS8  [SOP8-20-91]
U7  CH340T  [TSSOP-20]
U8  LC0504F  [SOT363]
U9  DS1307ZM/TR  [SOIC8_D8]
U10  MAX6369KA+T  [sot23_8]
Y1  S3B12.000F1210F30  [SMD_3225]
Y2  SF20WK32768D31T007  [SMD_2012]

### Nets
EGND: CON5.1(EP1) CON5.2(EP2) CON5.3(EP3) CON5.4(EP4)
GND: C58.2 C59.2 C60.2 C61.2 C62.2 C63.1 C64.2 C65.2 C66.2 C67.1 C68.2 C69.2 CON5.A1(GND) CON5.A12(GND) CON5.B1(GND) CON5.B12(GND) CON6.2(-) D9.2(CATHODE2) R64.2 R65.2 R69.2 R70.2 R71.2 U6.2(GND) U7.8(GND) U8.2 U9.4(VSS) U10.2(GND) Y1.2(NC0) Y1.4(NC1)
VDD_3V3_MAIN: D8.1(Anode) FB5.2 R73.1 R74.1
VDD_3V3_SOM_OUT: C58.1 C66.1 R66.1 R67.1 R68.1 U6.3(VCCA) U6.6(OE) U10.8(VCC)
VDD_5V_MAIN: FB4.2
VDD_5V_UART: C59.1 C61.1 C62.1 C63.2 FB3.1 U6.7(VCCB) U7.19(VCC)
1P12/RESETn/PU/3V3: D9.1(ANODE1) J4.2 ; off-sheet 1P12/RESETn/PU/3V3
AE20/UART0_TX_M0/Debug/3V3: U6.4(A2) ; off-sheet AE20/UART0_TX_M0/Debug/3V3
AE23/I2C0_SDA/PU/3V3: R74.2 U9.5(SDA) ; off-sheet AE23/I2C0_SDA/PU/3V3  [project net I2C0_SDA]
AF20/UART0_RX_M0/Debug/3V3: U6.5(A1) ; off-sheet AF20/UART0_RX_M0/Debug/3V3
AG23/I2C0_SCL/PU/3V3: R73.2 U9.6(SCL) ; off-sheet AG23/I2C0_SCL/PU/3V3  [project net I2C0_SCL]
CH340_RXD: U6.1(B2) U7.4(RXD)
CH340_TXD: U6.8(B1) U7.3(TXD)
MICRO_USB_DM: CON5.A7(DN1) CON5.B7(DN2) R63.2 U8.4
MICRO_USB_DP: CON5.A6(DP1) CON5.B6(DP2) R62.2 U8.6
S0: R66.2 R69.1 R76.1 U10.4(SET0)
S1: R67.2 R70.1 U10.5(SET1)
S2: R68.2 R71.1 U10.6(SET2)
UART_VBUS: CON5.A4(VBUS) CON5.A9(VBUS) CON5.B4(VBUS) CON5.B9(VBUS) FB3.2 U8.3
USBDM: R63.1 U7.7(UD-)
USBDP: R62.1 U7.6(UD+)
XL9555_P00/WDI/3V3: U10.1(WDI) ; off-sheet XL9555_P00/WDI/3V3
XL9555_P01/WD_SET/3V3: R76.2 ; off-sheet XL9555_P01/WD_SET/3V3
NetC60_1: C60.1 U7.5(V3)
NetC64_1: C64.1 U7.10(XO) Y1.1
NetC65_1: C65.1 U7.9(XI) Y1.3
NetC67_2: C67.2 FB4.1 FB5.1 R75.1 U9.8(VCC)
NetC68_1: C68.1 U9.2(X2) Y2.1
NetC69_1: C69.1 U9.1(X1) Y2.2
NetCON5_A5: CON5.A5(CC1) R64.1
NetCON5_B5: CON5.B5(CC2) R65.1
NetCON6_1: CON6.1(+) J3.2 U9.3(VBAT)
NetD8_2: D8.2(Cathode) R72.2
NetJ3_1: J3.1 R72.1
NetJ4_3: J4.3 U10.7(nWDO)
NetR75_2: R75.2 U9.7(FT/OUT)

Not connected (* = marked no-connect by the designer): CON5 A8(SBU1)* B8(SBU2)*; J4 1*; U7 1(CK0)* 2(ACT#)* 11(CTS#)* 12(DSR#)* 13(RI#)* 14(DCD#)* 15(DTR#)* 16(RTS#)* 17(NC.)* 18(R232)* 20(NOS#)*; U8 1* 5*; U10 3(NC)*

### Notes on the sheet
- USB TO UART0( DEBUG)
- 90 Ω (±10%) differential impedance
  Keep trace length as short as possible
- RTC
- HW WATCHDOG
- ML2032
- CR2032
- I2C0 bus have been pulled up in the SOM
- (near U9) ADDR:1101 000x (0x68)
  Maximum communication rate 100KHz
- DS1307ZM/TR(HGSEMI):     VCC=5V  ADDR:1101 000x (0x68)
  ISL1208IB8Z-TK(RENESAS): VCC=3V3 ADDR:1101 111x (0x6F)
  DS1340Z-33+(MAXIM):      VCC=3V3 ADDR:1101 000x (0x68)
- (in symbol Tronlong_TITTLE_20211115) Title; Size; Document Number; Date:; Sheet; of

### Library data of the parts
*#6 = Tronlong_TITTLE_20211115: RevCode: A?; Page Create Date: March  8, 1995
C58 C59 C62 C66 C67 = CAP NP_Dup3: 贴片陶瓷电容,100nF,10%,25V,X5R; Manufacturer Character: 中国大陆; Operation Temperature（℃）: -55~85℃; As-Welded: /; PCB Footprint: C0402; Temperature: -55~125℃
C60 = CAP NP_Dup3: 贴片陶瓷电容,10nF,10%,50V,X7R; Manufacturer Character: 中国大陆; Operation Temperature（℃）: -55~125℃; As-Welded: /; PCB Footprint: C0402; Temperature: –55~125℃
C61 C63 = CAP NP_Dup3: 贴片陶瓷电容,10uF,10%,10V,X5R; Manufacturer Character: 中国大陆; As-Welded: /; Operation Temperature（℃）: -55~85℃; PCB Footprint: C0603; Temperature: -55~125℃
C64 C65 = CAP NP_Dup3: 贴片陶瓷电容,22pF,5%,50V,C0G; Manufacturer Character: 中国大陆; Operation Temperature（℃）: -55~125℃; As-Welded: /; PCB Footprint: C0603; Temperature: -55~125℃
C68 C69 = CAP NP_Dup3: 贴片陶瓷电容,18pF,5%,50V,C0G; Manufacturer Character: 中国大陆; Operation Temperature（℃）: -55~125℃; As-Welded: DNP; PCB Footprint: C0603; Temperature: -40~125℃
CON5 = usb 3_0.0 type-c female: Type-C 母座 90度 16 Pin; Manufacturer Character: 中国大陆; Manufacturer: 深圳市金航标电子有限公司(kinghelm); Operation Temperature（℃）: -40~85℃; room: 10; As-Welded: /; Manufacturer PartNumber: KH-TYPE-C-16P; PCB Footprint: TYPE-C_16P_90_SMD
CON6 = BATTERY: 2032,纽扣电池座,2PIN,180度,白色,卧式,贴片; Manufacturer: 深圳市琦捷电子有限公司（Q&J）; Manufacturer Character: 中国大陆; As-Welded: /; room: 4; Manufacturer PartNumber: CR2032-BS-6-1; Temperature: -55~85℃; PCB Footprint: CON_BATTERY_CR2032
D8 = Diode200mA250V_1: 肖特基二极管,VR=40V,IF=350mA,VF=0.37V@20mA,trr=10ns; TIIntPartnumber: 1E0013; MfrNum: MMSD103T1G; Mfr: On Semiconductor; Manufacturer: 江苏长晶科技有限公司（JSCJ）; Manufacturer Character: 中国大陆; DescriptiveText: Diode 200mA 250V 1.25V Forward Drop; PCB Footprint: smd123; Cost10K: 0.07; Cost100: 0.23; Vendor: Digikey; As-Welded: /; Operation Temperature（℃）: -40~125℃; PartName: Diode200mA250V; Descriptive_Text: Diode 200mA 250V 1.25V Forward Drop; Manufacturer PartNumber: SD103AW; Temperature: -55~150℃
D9 = DIODE BREAKDOWN_2: TVS二极管,VRWM=5V,VBR=6V,一组,双向,30KV,30KV; Manufacturer Part Number: PESD3V3L1BA; Manufacturer: 上海雷卯电子科技有限公司（Leiditech）; Manufacturer Character: 中国大陆; room: KEY; Operation Temperature（℃）: -55~125℃; As-Welded: /; Temperature: -55~155℃; Manufacturer PartNumber: LC05CI; PCB Footprint: SOD323_BI
FB3 = FERRITE BEAD_Dup2: 磁珠,50mΩ,2.2A,220R@100MHz; Manufacturer: 深圳顺络电子股份有限公司（Sunlord）; Manufacturer PartNumber: UPZ1608U221-2R2TF; Manufacturer Character: 中国大陆; As-Welded: /; Operation Temperature（℃）: -55~125℃; Temperature: -55~125℃; PCB Footprint: L0603
FB4 = FERRITE BEAD_Dup2: 磁珠,50mΩ,2.2A,220R@100MHz; Manufacturer Character: 中国大陆; Manufacturer PartNumber: UPZ1608U221-2R2TF; Manufacturer: 深圳顺络电子股份有限公司（Sunlord）; As-Welded: /; Operation Temperature（℃）: -55~125℃; room: RGMII1; Temperature: -55~125℃; PCB Footprint: L0603
FB5 = FERRITE BEAD_Dup2: 磁珠,50mΩ,2.2A,220R@100MHz; Manufacturer PartNumber: UPZ1608U221-2R2TF; Manufacturer: 深圳顺络电子股份有限公司（Sunlord）; Manufacturer Character: 中国大陆; As-Welded: DNP; room: RGMII1; Operation Temperature（℃）: -55~125℃; Temperature: -55~125℃; PCB Footprint: L0603
J3 = CON2_0: 排针,1x2PIN,间距2.54MM,180度,黑色,插件; Manufacturer Character: 中国大陆; Manufacturer: 深圳市金航标电子有限公司(kinghelm); Operation Temperature（℃）: -55~105℃; As-Welded: /; PCB Footprint: header_1x2p_2d54_male; Manufacturer PartNumber: KH-2.54PH180-1X2P-L11.5; Temperature: -40~105℃
J4 = CON3_Dup2: 排针,1x3PIN,间距2.54MM,180度,黑色,插件; Manufacturer: 深圳市金航标电子有限公司(kinghelm); Manufacturer Character: 中国大陆; room: DAC; Operation Temperature（℃）: -55~105℃; As-Welded: /; PCB Footprint: CON3_2D254; Manufacturer PartNumber: KH-2.54PH180-1X3P-L11.5; Temperature: -55~105℃
R62 R63 = Resistor_Dup3: 贴片电阻,22R,±1%,1/16W; Manufacturer Character: 中国大陆; CLASS: DISCRETE; As-Welded: /; Operation Temperature（℃）: -55~155℃; PCB Footprint: R0402; Temperature: -55~155℃
R64 R65 = Resistor_Dup3: 贴片电阻,5.1K,±1%,1/16W; Manufacturer Character: 中国大陆; CLASS: DISCRETE; Operation Temperature（℃）: -55~155℃; room: JTAG; As-Welded: /; PCB Footprint: R0402; Temperature: -55~125℃
R66-R68 R75 = Resistor_Dup3: 贴片电阻,4.7K,±1%,1/16W; Manufacturer Character: 中国大陆; CLASS: DISCRETE; Operation Temperature（℃）: -55~155℃; As-Welded: /; PCB Footprint: R0402; Temperature: -55~155℃
R69 R70 R74 = Resistor_Dup3: 贴片电阻,4.7K,±1%,1/16W; Manufacturer Character: 中国大陆; CLASS: DISCRETE; Operation Temperature（℃）: -55~155℃; As-Welded: DNP; Temperature: -55~155℃; PCB Footprint: R0402
R71 R73 = Resistor_Dup3: 贴片电阻,4.7K,±1%,1/16W; Manufacturer Character: 中国大陆; CLASS: DISCRETE; As-Welded: DNP; Operation Temperature（℃）: -55~155℃; Temperature: -55~155℃; PCB Footprint: R0402
R72 = Resistor_Dup3: 贴片电阻,1K,±1%,1/16W; Manufacturer Character: 中国大陆; CLASS: DISCRETE; As-Welded: /; Operation Temperature（℃）: -55~155℃; room: EEPROM/RTC; PCB Footprint: R0402
R76 = Resistor_Dup3: 0R,±1%,R0402,≥1/16W; Manufacturer Character: 中国大陆; CLASS: DISCRETE; Operation Temperature（℃）: -55~155℃; As-Welded: /; PCB Footprint: R0402
U6 = TXS0102DCUR: 2位双向电平转换器; Manufacturer: 江苏润石科技有限公司（RUNIC）; Manufacturer Character: 中国大陆; As-Welded: /; Operation Temperature（℃）: -40~85℃; Temperature: -40~85℃; Manufacturer PartNumber: RS0102YVS8; PCB Footprint: SOP8-20-91
U7 = CH340T: USB转UART芯片; Manufacturer Character: 中国大陆; Manufacturer: 南京沁恒微电子股份有限公司（WCH）; As-Welded: /; Operation Temperature（℃）: -40~85℃; Temperature: -40~85℃; Manufacturer PartNumber: CH340T; PCB Footprint: TSSOP-20
U8 = PRTR5V0U4Y_0: ESD二极管,VRWM=5V,VBR=6V,四组,单向,8KV,15KV; Manufacturer: 上海雷卯电子科技有限公司（Leiditech）; Manufacturer Character: 中国大陆; As-Welded: /; room: SD; Operation Temperature（℃）: -55~125℃; Manufacturer Part Number: PRTR5V0U4Y; Manufacturer PartNumber: LC0504F; Temperature: -40~85℃; PCB Footprint: SOT363
U9 = IC_MCP79410_0: RTC芯片; Manufacturer Character: 中国大陆; Manufacturer: 广东华冠半导体有限公司（HGSEMI）; As-Welded: /; Operation Temperature（℃）: -40~85℃; Temperature: -40~85℃; Manufacturer PartNumber: DS1307ZM/TR; PCB Footprint: SOIC8_D8
U10 = MAX637x: 低电平有效开漏输出,2.5V-5.5V,-40~125℃; Manufacturer Character: 国外; Manufacturer: Maxim Integrated（美国美信）; As-Welded: /; Temperature: -40~125℃; Manufacturer PartNumber: MAX6369KA+T; Operation Temperature（℃）: -40~125℃; PCB Footprint: sot23_8
Y1 = CRYSTAL: 四脚无源晶振,12MHz,±10ppm,12pF,100Ω,±30ppm; Manufacturer Character: 中国大陆; Manufacturer: 深圳市星通时频电子有限公司公司（JSCJ）; As-Welded: /; Operation Temperature（℃）: -40~85℃; Temperature: -40~85℃; Manufacturer PartNumber: S3B12.000F1210F30; PCB Footprint: SMD_3225
Y2 = CRYS_32_768KHz_SMD: 两脚无源晶振,32.768KHz,±20ppm,12.5pF,80KΩ,±20ppm; PartName: Crystal32.768KHzMC306; Mfr: Epson; MfrNum: MC-30632.7680k-A; TIIntPartnumber: 1Y0029; Manufacturer: 湖北泰晶电子科技股份有限公司（TKD）; Manufacturer Character: 中国大陆; TN: tbd; Vendor: Digikey; Cost100: 0.41; Cost10K: 0.338; PCB Footprint: smd; As-Welded: /; Operation Temperature（℃）: -40~85℃; Manufacturer PartNumber: SF20WK32768D31T007; Temperature: -40~85℃